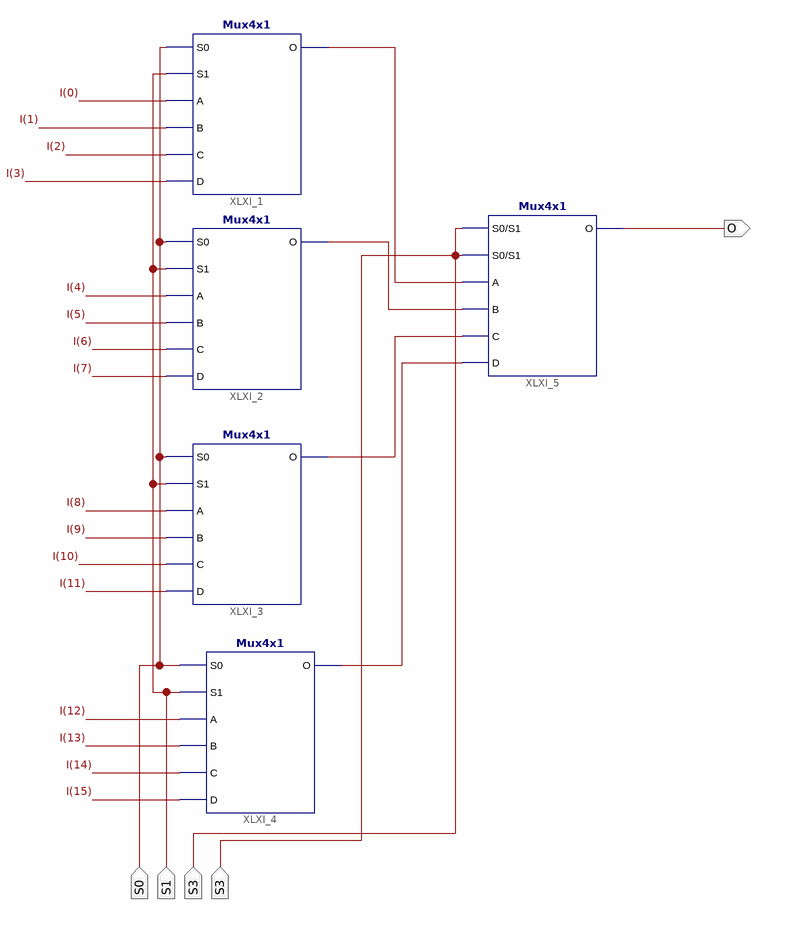
[diagram p0: schematic sheet 1]
// Xilinx ISE schematic Mux16x4.sch (artix7) as structural Verilog: 5 symbols, 4 ports
module Mux16x4 (
  input  S0,
  input  S1,
  input  S3,
  output O
);

  wire XLXN_9, XLXN_10, XLXN_11, XLXN_12;
  wire [15:0] I;

  Mux4x1 XLXI_1 (.S0(S0), .S1(S1), .A(I[0]), .B(I[1]), .C(I[2]), .D(I[3]), .O(XLXN_9));
  Mux4x1 XLXI_2 (.S0(S0), .S1(S1), .A(I[4]), .B(I[5]), .C(I[6]), .D(I[7]), .O(XLXN_10));
  Mux4x1 XLXI_3 (.S0(S0), .S1(S1), .A(I[8]), .B(I[9]), .C(I[10]), .D(I[11]), .O(XLXN_11));
  Mux4x1 XLXI_4 (.S0(S0), .S1(S1), .A(I[12]), .B(I[13]), .C(I[14]), .D(I[15]), .O(XLXN_12));
  Mux4x1 XLXI_5 (.S0(S3), .S1(S3), .A(XLXN_9), .B(XLXN_10), .C(XLXN_11), .D(XLXN_12), .O(O));
endmodule
